# EAGLE design Moisture Gauge (EAGLE 7.7.0)
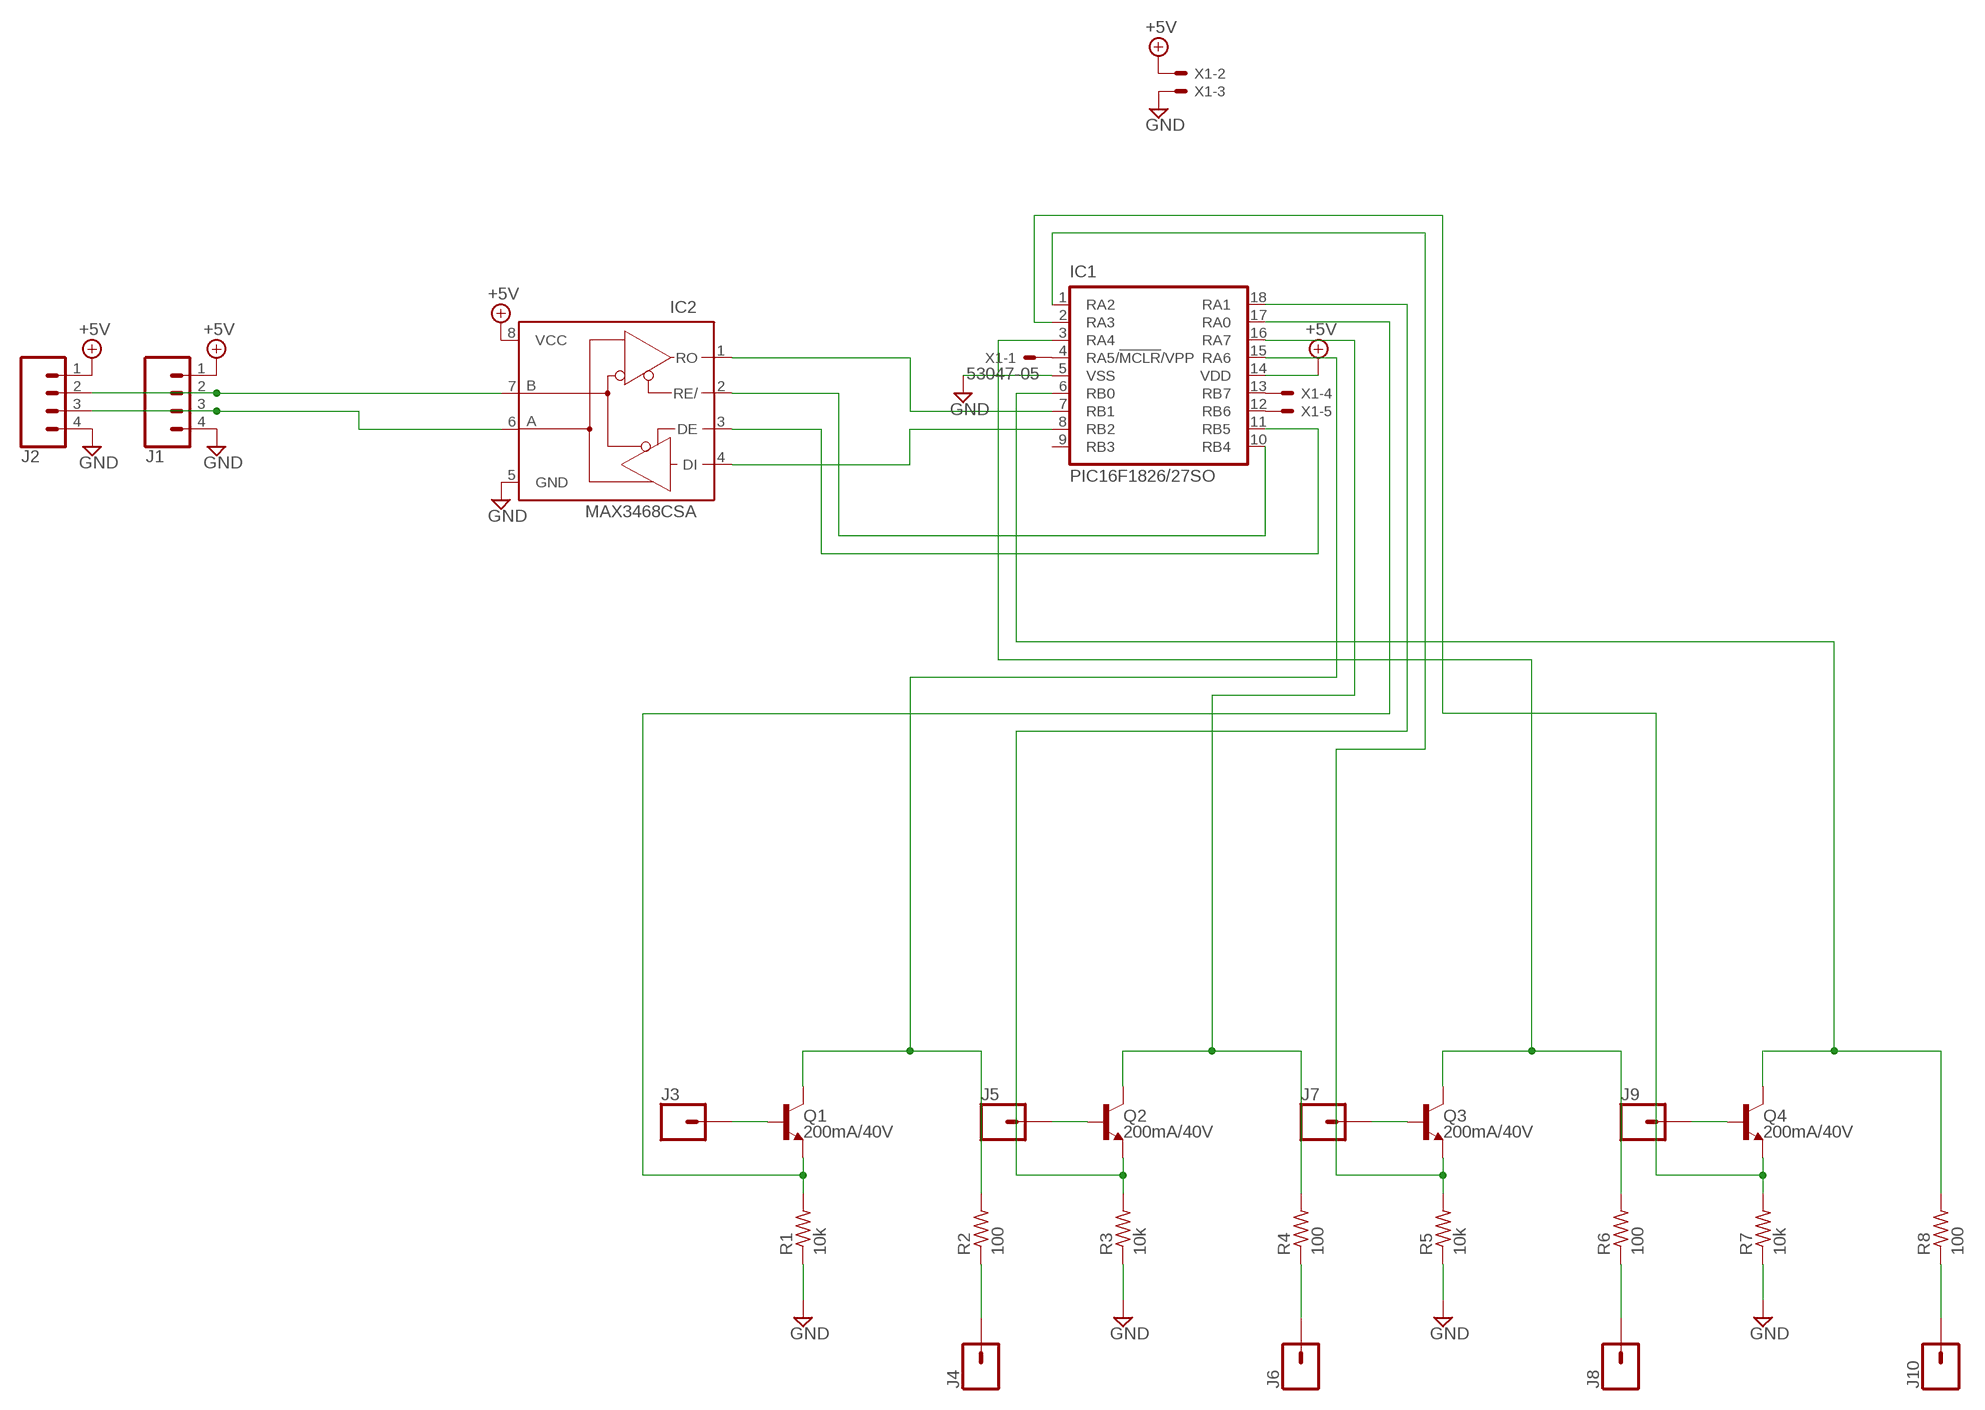
[diagram p0: schematic, sheet 1]

## Parts
IC1  PIC16F1826/27SO  [SO-18W]
IC2  MAX3468CSA  [SO08]
J1  CONN_04SCREW  [SCREWTERMINAL-3.5MM-4]
J2  CONN_04SCREW  [SCREWTERMINAL-3.5MM-4]
J3  CONN_01PTH_2MM  [1X01_2MM]
J4  CONN_01PTH_2MM  [1X01_2MM]
J5  CONN_01PTH_2MM  [1X01_2MM]
J6  CONN_01PTH_2MM  [1X01_2MM]
J7  CONN_01PTH_2MM  [1X01_2MM]
J8  CONN_01PTH_2MM  [1X01_2MM]
J9  CONN_01PTH_2MM  [1X01_2MM]
J10  CONN_01PTH_2MM  [1X01_2MM]
Q1  200mA/40V  TRANS_NPN-2N3904  [TO-92]
Q2  200mA/40V  TRANS_NPN-2N3904  [TO-92]
Q3  200mA/40V  TRANS_NPN-2N3904  [TO-92]
Q4  200mA/40V  TRANS_NPN-2N3904  [TO-92]
R1  10k  R-US_M1206  [M1206]
R2  100  R-US_M1206  [M1206]
R3  10k  R-US_M1206  [M1206]
R4  100  R-US_M1206  [M1206]
R5  10k  R-US_M1206  [M1206]
R6  100  R-US_M1206  [M1206]
R7  10k  R-US_M1206  [M1206]
R8  100  R-US_M1206  [M1206]
X1  53047-05  [53047-05]

## Nets
+5V: IC1.14(VDD) IC2.8(VCC) J1.1 J2.1 X1.2
GND: IC1.5(VSS) IC2.5(GND) J1.4 J2.4 R1.1 R3.1 R5.1 R7.1 X1.3
N$1: IC1.17(RA0) Q1.1(E) R1.2
N$2: IC1.18(RA1) Q2.1(E) R3.2
N$3: IC1.15(RA6) Q1.3(C) R2.2
N$4: IC1.3(RA4) Q3.3(C) R6.2
N$5: IC1.1(RA2) Q3.1(E) R5.2
N$6: IC1.6(RB0) Q4.3(C) R8.2
N$7: IC1.2(RA3) Q4.1(E) R7.2
N$8: IC1.11(RB5) IC2.3(DE)
N$9: IC2.7(B) J1.2 J2.2
N$10: IC2.6(A) J1.3 J2.3
N$11: IC1.7(RB1) IC2.1(RO)
N$12: IC1.8(RB2) IC2.4(DI)
N$13: IC1.10(RB4) IC2.2(RE/)
N$15: IC1.4(RA5/!MCLR!/VPP) X1.1
N$16: IC1.13(RB7) X1.4
N$17: IC1.12(RB6) X1.5
N$18: IC1.16(RA7) Q2.3(C) R4.2
P1A: J3.1 Q1.2(B)
P1B: J4.1 R2.1
P2A: J5.1 Q2.2(B)
P2B: J6.1 R4.1
P3A: J7.1 Q3.2(B)
P3B: J8.1 R6.1
P4A: J9.1 Q4.2(B)
P4B: J10.1 R8.1
Unconnected: IC1.9(RB3)

## Library data of the parts
IC1 = microchip:PIC16*F1826/27: 18/20/28-Pin Flash Microcontrollers with nanoWatt XLP Technology Source: www.microchip.com PIC16F1827.pdf
IC2 = maxim:MAX34*: +5V, Fail-Safe, 40Mbps, Profibus RS-485/RS-422 Transceivers Source: MAX3465-MAX3469.pdf; MPN: MAX3468CSA+; OC_FARNELL: unknown; OC_NEWARK: 76K6721
J1 J2 = SparkFun-Connectors:CONN_04: Multi connection point. Often used as Generic Header-pin footprint for 0.1 inch spaced/style header connections On any of the 0.1 inch spaced packages, you can populate with these: Break Away Headers - Straight <https://www.sparkfun.com/products/116> (PRT-00116) Break Away Male Headers - Right Angle <https://www.sparkfun.com/products/553> (PRT-00553) Female Headers <https://www.sparkfun.com/products/115> (PRT-00115) Break Away Headers - Machine Pin <https://www.sparkfun.com/products/117> (PRT-00117) Break Away Female Headers - Swiss Machine Pin <https://www.sparkfun.com/products/743> (PRT-00743) For SCREWTERMINALS and SPRING TERMINALS visit here: Screw Terimnals on SparkFun.com <https://www.sparkfun.com/search/results?term=Screw+Terminals> (5mm/3.5mm/2.54mm spacing) This device is also useful as a general connection point to wire up your design to another part of your project. Our various solder wires solder well into these plated through hole pads. Hook-Up Wire - Assortment (Stranded, 22 AWG) <https://www.sparkfun.com/products/11375> (PRT-11375) Hook-Up Wire - Assortment (Solid Core, 22 AWG) <https://www.sparkfun.com/products/11367> (PRT-11367) View the entire wire category on our website here <https://www.sparkfun.com/categories/141> Special notes: Molex polarized connector foot print use with SKU : PRT-08231 with associated crimp pins and housings. 1MM SMD Version SKU: PRT-10208; PROD_ID: 2xCONN-08399; SF_ID: 2xPRT-08084
J3-J10 = SparkFun-Connectors:CONN_01: Single connection point. Often used as Generic Header-pin footprint for 0.1 inch spaced/style header connections On any of the 0.1 inch spaced packages, you can populate with these: Break Away Headers - Straight <https://www.sparkfun.com/products/116> (PRT-00116) Break Away Male Headers - Right Angle <https://www.sparkfun.com/products/553> (PRT-00553) Female Headers <https://www.sparkfun.com/products/115> (PRT-00115) Break Away Headers - Machine Pin <https://www.sparkfun.com/products/117> (PRT-00117) Break Away Female Headers - Swiss Machine Pin <https://www.sparkfun.com/products/743> (PRT-00743) This device is also useful as a general connection point to wire up your design to another part of your project. Our various solder wires solder well into these plated through hole pads. Hook-Up Wire - Assortment (Stranded, 22 AWG) <https://www.sparkfun.com/products/11375> (PRT-11375) Hook-Up Wire - Assortment (Solid Core, 22 AWG) <https://www.sparkfun.com/products/11367> (PRT-11367) View the entire wire category on our website here <https://www.sparkfun.com/categories/141> Special notes: SMTSO-256-ET is a "flush mount" nut for a 4-40 screw. We mostly use this on specialty testbeds; it is a nice way to connect hardware to your PCB at an adjustable hieght. Also note, the SNAP packages are for using a snappable style connector. We sell a baggie of snaps and they are also used on two LilyPad designs: Snap Assortment - 30 pack (male and female) <https://www.sparkfun.com/products/11347> (DEV-11347) LilyPad Arduino SimpleSnap <https://www.sparkfun.com/products/10941> (DEV-10941) LilyPad SimpleSnap Protoboard <https://www.sparkfun.com/products/10940> (DEV-10940)
Q1-Q4 = SparkFun-DiscreteSemi:TRANS_NPN: NPN transistor Current controlled devices typically used to amplify current or used as a switch. BC547 - COM-08928 <http://www.sparkfun.com/products/8928> (TO-92 45V 100mA) (1.Collector 2.Base 3.Emitter) 2N3904 - COM-00521 <http://www.sparkfun.com/products/521> (TO-92 40V 200mA) (1.Emitter 2.Base 3.Collector) P2N2222A - COM-12852 <http://www.sparkfun.com/products/12852> (TO-92 40V 600mA) (1.Collector 2.Base 3.Emitter); PROD_ID: TRANS-08447
R1-R8 = resistor:R-US_: RESISTOR, American symbol
X1 = con-molex:53?-05: CONNECTOR wire to board 1.25 mm (.049 inch) pitch header; MF: MOLEX; MPN: 53047-0510; OC_FARNELL: 9732861; OC_NEWARK: 38C9901

## Board
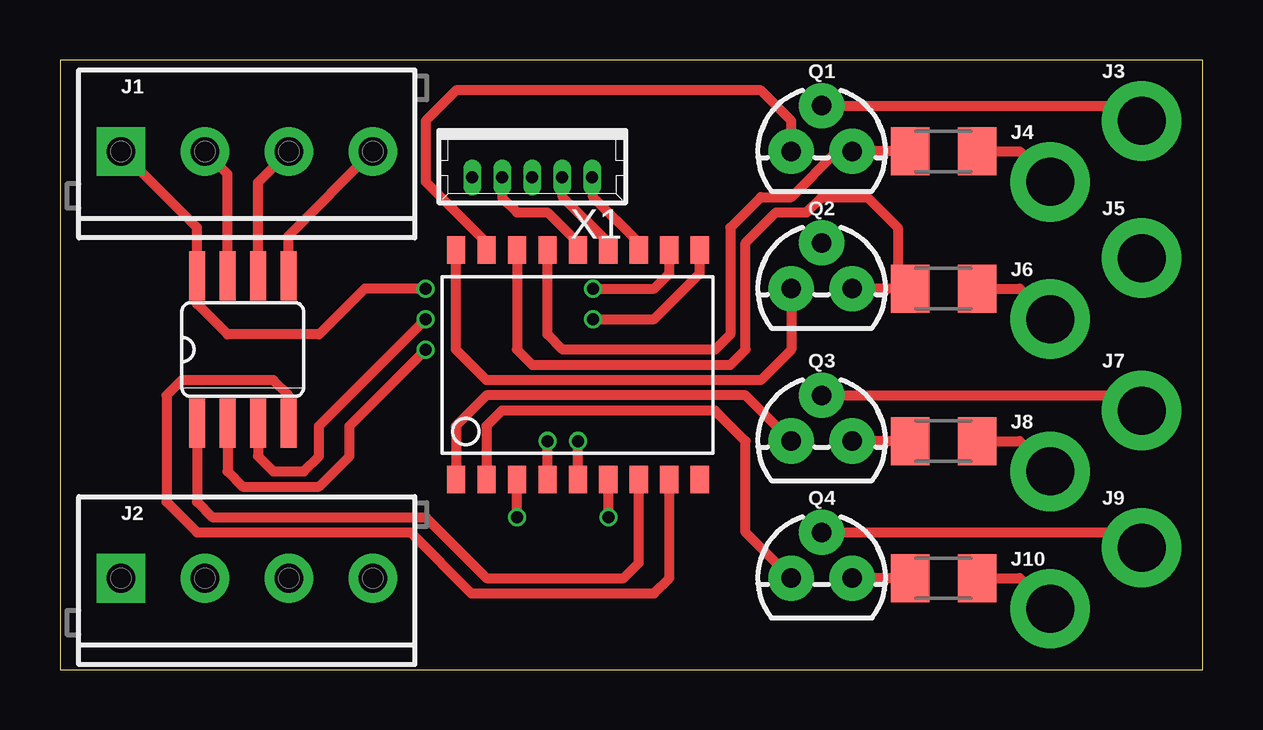
[diagram p1: board, top side]
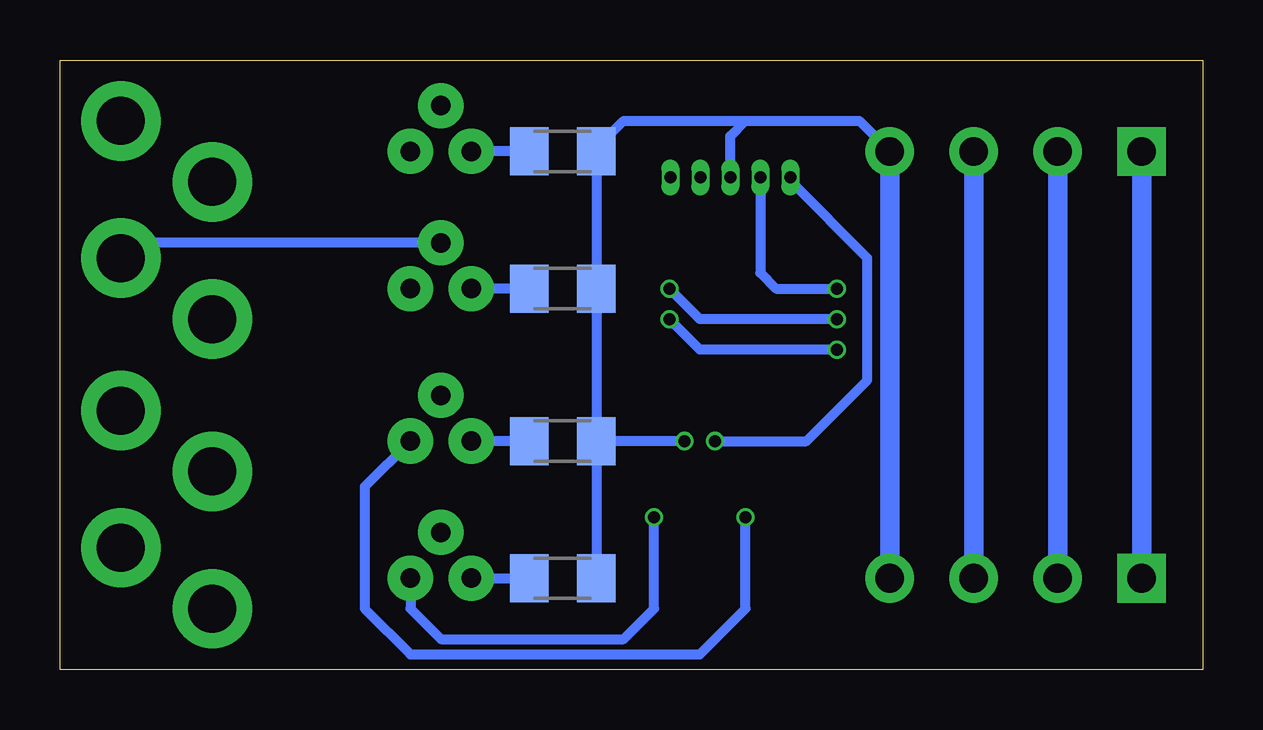
[diagram p2: board, bottom side, seen from below]

Size 47.62 x 25.4 mm. Coordinates in mm from the lower left corner, seen from the top.
Outline: 0,0 47.62,0 47.62,25.4 0,25.4 0,0
Copper layers (1*16): Top 0.035559375mm / dielectric 1.6mm / Bottom 0.035559375mm
Design rules "oshpark-2layer": minimum track width 6mil, minimum drill 10mil, track to track 6mil, track to pad 6mil, pad to pad 6mil, via to via 6mil, smd to smd 6mil, copper to edge 15mil, drill to drill 6mil, minimum pad ring 5mil, minimum via ring 5mil, stop-mask expansion 2.5mil, vias tented up to drill 0mil, thermal gap 10mil

### Footprints (pad centres in the part's own frame; a part is rotated, then mirrored left to right if it is on the bottom)
SO-18W = smd 0.762 x 1.143: 1 -5.08,-4.788; 2 -3.81,-4.788; 3 -2.54,-4.788; 4 -1.27,-4.788; 5 0,-4.788; 6 1.27,-4.788; 7 2.54,-4.788; 8 3.81,-4.788; 9 5.08,-4.788; 10 5.08,4.788; 11 3.81,4.788; 12 2.54,4.788; 13 1.27,4.788; 14 0,4.788; 15 -1.27,4.788; 16 -2.54,4.788; 17 -3.81,4.788; 18 -5.08,4.788
SO08 = smd 0.66 x 2.032: 1 -1.905,-3.073; 2 -0.635,-3.073; 3 0.635,-3.073; 4 1.905,-3.073; 5 1.905,3.073; 6 0.635,3.073; 7 -0.635,3.073; 8 -1.905,3.073
SCREWTERMINAL-3.5MM-4 = drill 1.2 pad 2.032 square: 1 0,0 | drill 1.2 pad 2.032: 2 3.5,0; 3 7,0; 4 10.5,0
1X01_2MM = drill 2 pad 3.302: 1 0,0
TO-92 = drill 0.813 pad 1.88: 1 -1.27,0; 2 0,1.905; 3 1.27,0
M1206 = smd 1.6 x 2: 1 -1.4,0; 2 1.4,0
53047-05 = drill 0.5 pad 0.698 long: 1 2.5,0.45; 2 1.25,0.45; 3 0,0.45; 4 -1.25,0.45; 5 -2.5,0.45

### Placement (x,y rotation side)
IC1  21.59,12.7 0 top
IC2  7.62,13.34 0 top
J1  2.54,21.59 0 top
J2  2.54,3.81 0 top
J3  45.09,22.86 0 top
J4  41.27,20.32 0 top
J5  45.09,17.14 0 top
J6  41.27,14.61 0 top
J7  45.09,10.79 0 top
J8  41.27,8.26 0 top
J9  45.09,5.08 0 top
J10  41.27,2.54 0 top
Q1  31.75,21.59 0 top
Q2  31.75,15.88 0 top
Q3  31.75,9.53 0 top
Q4  31.75,3.81 0 top
R1  26.67,21.59 180 bottom
R2  36.83,21.59 180 top
R3  26.67,15.88 180 bottom
R4  36.83,15.88 180 top
R5  26.67,9.53 180 bottom
R6  36.83,9.53 180 top
R7  26.67,3.81 180 bottom
R8  36.83,3.81 180 top
X1  19.68,20.95 180 top

### Tracks (layer width: path | path; a pad name or v marks a point on that pad's centre or on a via)
+5V  (via drill 0.5)
  Top 0.406: J1.1 5.71,18.41 IC2.8 5.71,15.24 6.99,13.97 10.79,13.97 12.7,15.88 v15.24,15.88 | X1.2 18.43,19.66 19.05,19.05 20.32,19.05 21.59,17.78 IC1.14
  Bottom 0.406: X1.2 18.43,16.53 17.78,15.88 v15.24,15.88
  Bottom 0.813: J1.1 J2.1
GND  (via drill 0.5)
  Top 0.406: IC2.5 9.53,18.07 J1.4 | IC1.5 v21.59,9.53
  Bottom 0.406: R5.1 R3.1 R1.1 25.27,21.72 24.13,22.86 19.05,22.86 | R5.1 R7.1 | X1.3 19.68,22.23 19.05,22.86 | 19.05,22.86 14.31,22.86 J1.4 | v21.59,9.53 R5.1
  Bottom 0.813: J1.4 J2.4
N$1
  Top 0.406: Q1.1 30.48,22.86 29.21,24.13 16.51,24.13 15.24,22.86 15.24,20.32 17.78,17.78 IC1.17
  Bottom 0.406: R1.2 Q1.1
N$2
  Top 0.406: Q2.1 30.48,13.34 29.21,12.06 17.78,12.06 16.51,13.34 IC1.18
  Bottom 0.406: R3.2 Q2.1
N$3
  Top 0.406: R2.2 Q1.3 32.38,21.59 30.48,19.68 29.21,19.68 27.94,18.41 27.94,13.97 27.3,13.34 20.95,13.34 20.32,13.97 IC1.15
N$4  (via drill 0.5)
  Top 0.406: R6.2 Q3.3 | v19.05,6.35 IC1.3
  Bottom 0.406: Q3.3 34.92,7.62 34.92,2.54 33.02,0.64 20.95,0.64 19.05,2.54 v19.05,6.35
N$5
  Top 0.406: Q3.1 28.57,11.43 17.78,11.43 16.51,10.16 IC1.1
  Bottom 0.406: R5.2 Q3.1
N$6  (via drill 0.5)
  Top 0.406: R8.2 Q4.3 | v22.86,6.35 IC1.6
  Bottom 0.406: Q4.3 33.02,2.54 31.75,1.27 24.13,1.27 22.86,2.54 v22.86,6.35
N$7
  Top 0.406: Q4.1 28.57,5.71 28.57,9.53 27.3,10.79 18.41,10.79 17.78,10.16 IC1.2
  Bottom 0.406: Q4.1 R7.2
N$8  (via drill 0.5)
  Top 0.406: IC2.3 8.26,8.89 8.89,8.26 10.16,8.26 10.79,8.89 10.79,10.16 v15.24,14.61 | v22.23,15.88 24.77,15.88 25.4,16.51 IC1.11
  Bottom 0.406: v15.24,14.61 20.95,14.61 v22.23,15.88
N$9
  Top 0.406: IC2.7 6.99,20.64 J1.2
  Bottom 0.813: J1.2 J2.2
N$10
  Top 0.406: IC2.6 8.26,20.3 J1.3
  Bottom 0.813: J1.3 J2.3
N$11
  Top 0.406: IC2.1 5.71,6.99 6.35,6.35 15.24,6.35 17.78,3.81 23.5,3.81 24.13,4.45 IC1.7
N$12
  Top 0.406: IC2.4 9.53,11.43 8.89,12.06 5.08,12.06 4.45,11.43 4.45,6.99 5.71,5.71 14.61,5.71 17.14,3.17 24.77,3.17 25.4,3.81 IC1.8
N$13  (via drill 0.5)
  Top 0.406: IC2.2 6.99,8.26 7.62,7.62 10.79,7.62 12.06,8.89 12.06,10.16 v15.24,13.34 | v22.23,14.61 24.77,14.61 26.67,16.51 IC1.10
  Bottom 0.406: v15.24,13.34 20.95,13.34 v22.23,14.61
N$15  (via drill 0.5)
  Top 0.406: IC1.4 v20.32,9.53
  Bottom 0.406: v20.32,9.53 16.51,9.53 13.97,12.06 13.97,17.14 17.14,20.32 17.14,20.46 X1.1
N$16
  Top 0.406: IC1.13 22.86,17.78 20.95,19.68 20.95,20.48 X1.4
N$17
  Top 0.406: IC1.12 24.13,17.78 22.23,19.68 22.23,20.46 X1.5
N$18
  Top 0.406: R4.2 34.92,15.88 | 34.92,15.88 Q2.3 | IC1.16 19.05,13.34 19.68,12.7 27.94,12.7 28.57,13.34 28.57,17.78 29.84,19.05 31.11,19.05 31.75,19.68 33.66,19.68 34.92,18.41 34.92,15.88
P1A
  Top 0.406: Q1.2 44.45,23.5 J3.1
P1B
  Top 0.406: R2.1 40.01,21.59 J4.1
P2A
  Bottom 0.406: Q2.2 44.45,17.78 J5.1
P2B
  Top 0.406: R4.1 40.01,15.88 J6.1
P3A
  Top 0.406: Q3.2 44.45,11.43 J7.1
P3B
  Top 0.406: R6.1 40.01,9.53 J8.1
P4A
  Top 0.406: Q4.2 44.45,5.71 J9.1
P4B
  Top 0.406: R8.1 40.01,3.81 J10.1